# EAGLE design CO2_Ampel - V1.3 (EAGLE 9.6.2)
ORIGINATOR: Julian Weis
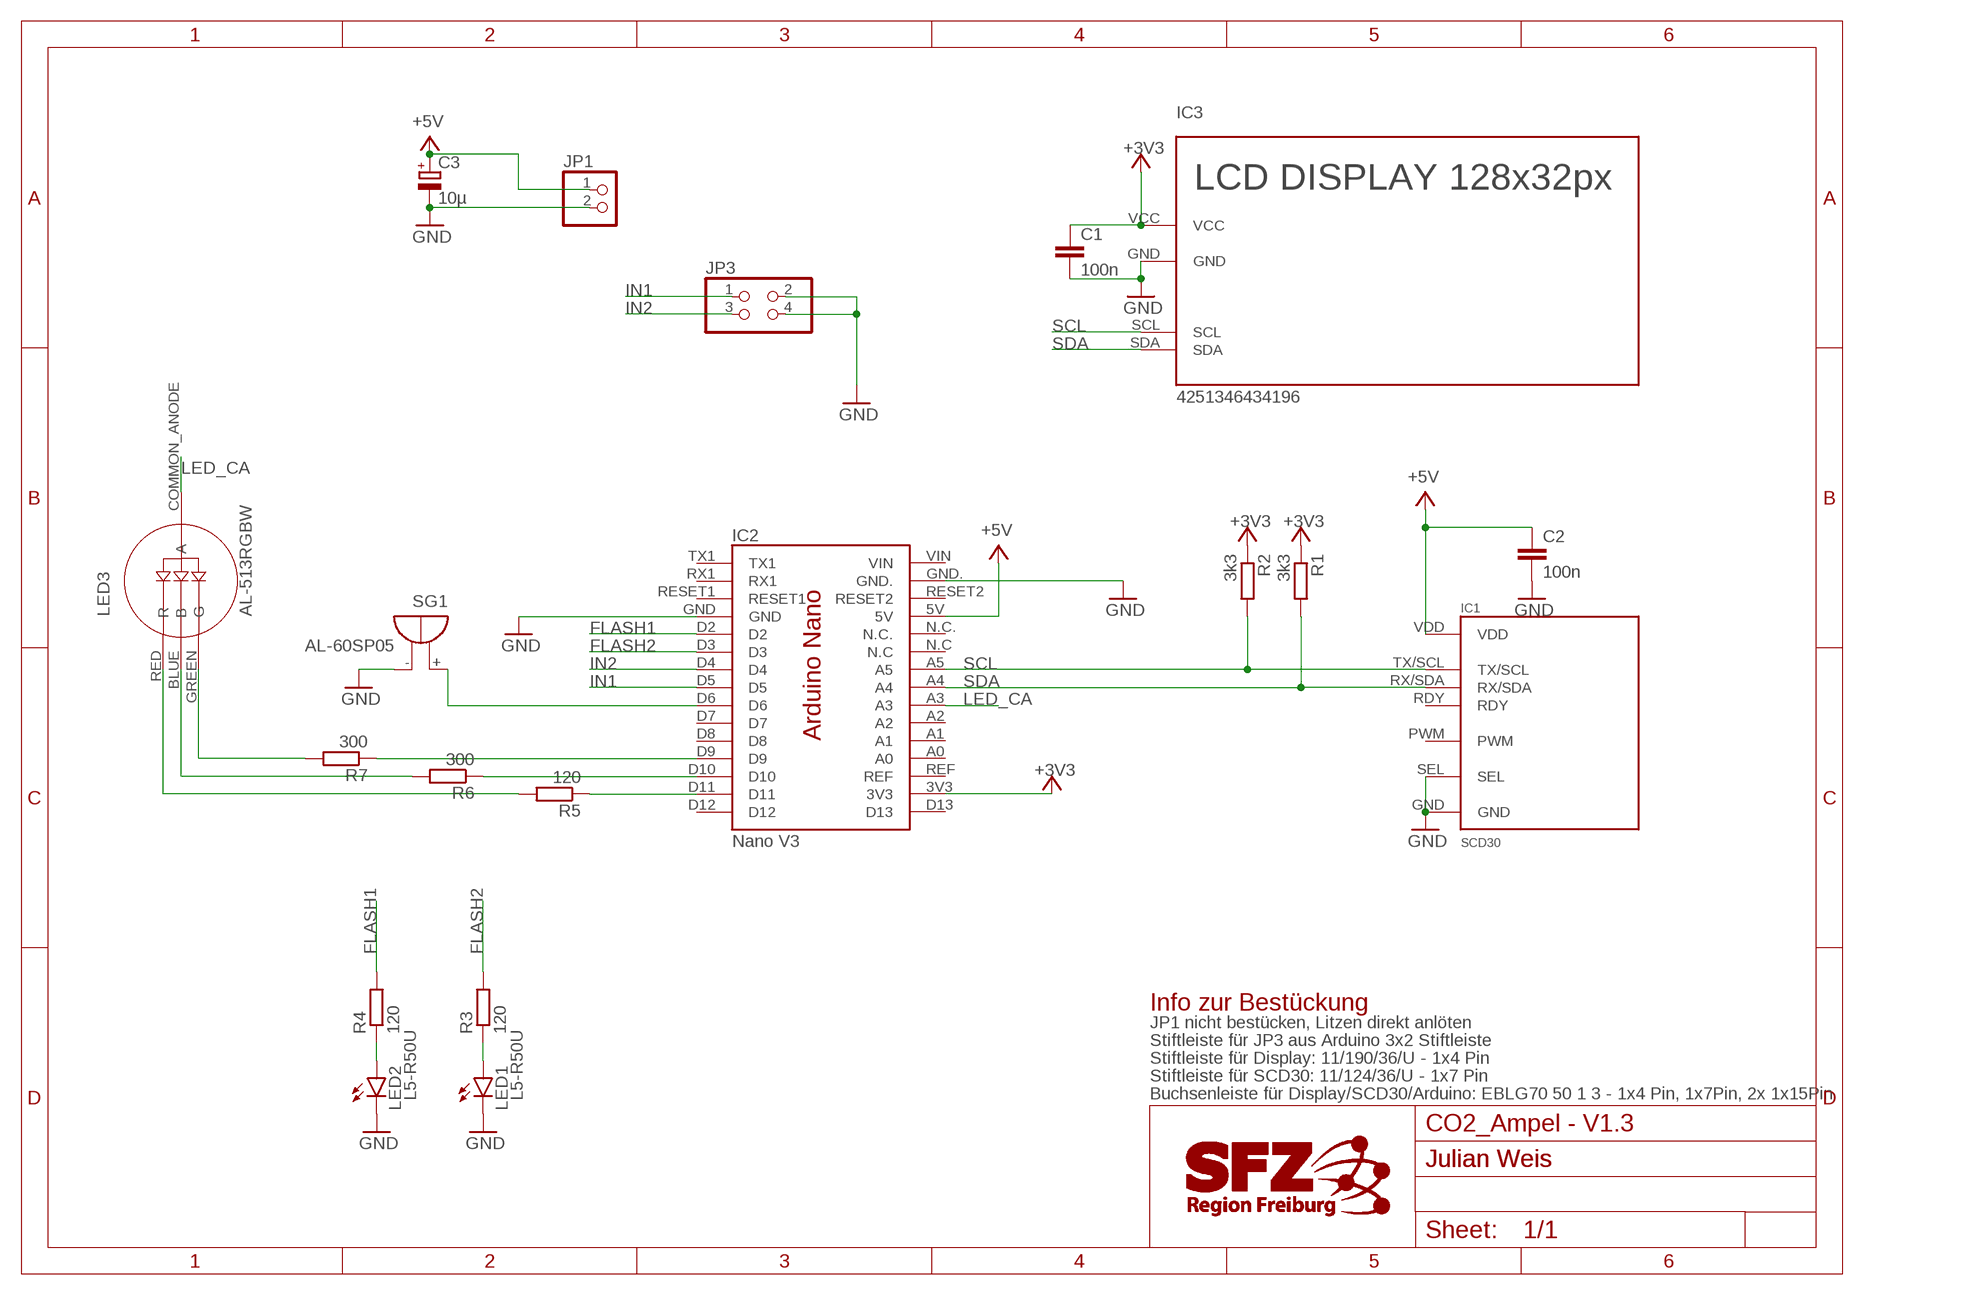
[diagram p0: schematic, sheet 1]

## Parts
C1  100n  C-EU050-025X075  [C050-025X075]
C2  100n  C-EU050-025X075  [C050-025X075]
C3  10µ  CPOL-EUE2-5  [E2-5]
IC1  SCD30  [SCD30]
IC2  Nano V3  ARDUINO_NANO  [ARDUINO_NANO]
IC3  4251346434196  0.91"OLED_128X32_I2C  [0.91INCH_128X32_I2C_12X38MM]
JP1  PINHD-1X2  [1X02]
JP3  PINHD-2X2  [2X02]
LED1  L5-R50U  LEDLED5MM_LIEGEND  [LED5MM_LIEGEND]
LED2  L5-R50U  LEDLED5MM_LIEGEND_GESPIEGELT  [LED5MM_LIEGEND_GESPIEGELT]
LED3  AL-513RGBW  LED-4_PIN  [LED-4_PIN]
R1  3k3  R-EU_0207/10  [0207/10]
R2  3k3  R-EU_0207/10  [0207/10]
R3  120  R-EU_0207/10  [0207/10]
R4  120  R-EU_0207/10  [0207/10]
R5  120  R-EU_0207/10  [0207/10]
R6  300  R-EU_0207/10  [0207/10]
R7  300  R-EU_0207/10  [0207/10]
SG1  AL-60SP05  F/TMB  [F/TMB]

## Nets
+3V3: C1.1 IC2.3V3 IC3.VCC R1.1 R2.1
+5V: C2.1 C3.+ IC1.VDD IC2.5V JP1.1
FLASH1: IC2.D2 R4.2
FLASH2: IC2.D3 R3.2
GND: C1.2 C2.2 C3.- IC1.GND IC1.SEL IC2.GND. IC3.GND JP1.2 JP3.2 JP3.4 LED1.K(C) LED2.K(C) SG1.-
IN1: IC2.D5 JP3.1
IN2: IC2.D4 JP3.3
LED_CA: IC2.A3 LED3.COMMON_ANODE(A)
N$1: LED3.RED(R) R5.2
N$2: LED3.BLUE(B) R6.2
N$3: LED2.A R4.1
N$4: LED1.A R3.1
N$5: LED3.GREEN(G) R7.2
N$6: IC2.D9 R7.1
N$7: IC2.D10 R6.1
N$8: IC2.D11 R5.1
N$9: IC2.D6 SG1.+
N$10: IC2.GND ; supply symbol labelled GND
SCL: IC1.TX/SCL IC2.A5 IC3.SCL R2.2
SDA: IC1.RX/SDA IC2.A4 IC3.SDA R1.2
Unconnected: IC1.PWM IC1.RDY IC2.A0 IC2.A1 IC2.A2 IC2.D7 IC2.D8 IC2.D12 IC2.D13 IC2.N.C IC2.N.C. IC2.REF IC2.RESET1 IC2.RESET2 IC2.RX1 IC2.TX1 IC2.VIN

## Notes on the sheet
- Info zur Bestückung
- JP1 nicht bestücken, Litzen direkt anlöten
- Stiftleiste für JP3 aus Arduino 3x2 Stiftleiste
- Stiftleiste für Display: 11/190/36/U - 1x4 Pin
- Stiftleiste für SCD30: 11/124/36/U - 1x7 Pin
- Buchsenleiste für Display/SCD30/Arduino: EBLG70 50 1 3 - 1x4 Pin, 1x7Pin, 2x 1x15Pin

## Library data of the parts
C1 C2 = rcl:C-EU: CAPACITOR, European symbol; SPICEPREFIX: C
C3 = LED_Lampe_Arduino_Eagle_V3:CPOL-EU
IC1 = sensirion:SCD30: Sensirion SCD30 Sensor Module CO2, humidity, and temperature sensor ▪ NDIR CO2 sensor technology ▪ Integrated temperature and humidity sensor ▪ Best performance-to-price ratio ▪ Dual-channel detection for superior stability ▪ Small form factor: 35 mm x 23 mm x 7 mm ▪ Measurement range: 400 ppm – 10.000 ppm ▪ Accuracy: ±(30 ppm + 3%) ▪ Current consumption: 19 mA @ 1 meas. per 2 s. ▪ Fully calibrated and linearized ▪ Digital interface UART or I2C SCD30 Datasheet <https://www.sensirion.com/fileadmin/user_upload/customers/sensirion/Dokumente/9.5_CO2/Sensirion_CO2_Sensors_SCD30_Datasheet.pdf> SCD30 Defign-In Guide <https://www.sensirion.com/fileadmin/user_upload/customers/sensirion/Dokumente/9.5_CO2/Sensirion_SCD30_Design-In_Guidelines_D1.pdf> More Downloads <https://www.sensirion.com/de/download-center/kohlendioxidsensoren-co2/co2-sensor/>
IC2 = Arduino:ARDUINO_NANO
IC3 = display-lcd:0.91"OLED_128X32_I2C
JP1 = pinhead:PINHD-1X2: PIN HEADER
JP3 = pinhead:PINHD-2X2: PIN HEADER
LED1 LED2 = led:LED: LED OSRAM: - CHIPLED LG R971, LG N971, LY N971, LG Q971, LY Q971, LO R971, LY R971 LH N974, LH R974 LS Q976, LO Q976, LY Q976 LO Q996 - Hyper CHIPLED LW Q18S LB Q993, LB Q99A, LB R99A - SideLED LS A670, LO A670, LY A670, LG A670, LP A670 LB A673, LV A673, LT A673, LW A673 LH A674 LY A675 LS A676, LA A676, LO A676, LY A676, LW A676 LS A679, LY A679, LG A679 - Hyper Micro SIDELED® LS Y876, LA Y876, LO Y876, LY Y876 LT Y87S - SmartLED LW L88C, LW L88S LB L89C, LB L89S, LG L890 LS L89K, LO L89K, LY L89K LS L896, LA L896, LO L896, LY L896 - TOPLED LS T670, LO T670, LY T670, LG T670, LP T670 LSG T670, LSP T670, LSY T670, LOP T670, LYG T670 LG T671, LOG T671, LSG T671 LB T673, LV T673, LT T673, LW T673 LH T674 LS T676, LA T676, LO T676, LY T676, LB T676, LH T676, LSB T676, LW T676 LB T67C, LV T67C, LT T67C, LS T67K, LO T67K, LY T67K, LW E67C LS E67B, LA E67B, LO E67B, LY E67B, LB E67C, LV E67C, LT E67C LW T67C LS T679, LY T679, LG T679 LS T770, LO T770, LY T770, LG T770, LP T770 LB T773, LV T773, LT T773, LW T773 LH T774 LS E675, LA E675, LY E675, LS T675 LS T776, LA T776, LO T776, LY T776, LB T776 LHGB T686 LT T68C, LB T68C - Hyper Mini TOPLED® LB M676 - Mini TOPLED Santana® LG M470 LS M47K, LO M47K, LY M47K Source: http://www.osram.convergy.de LUXEON: - LUMILED® LXK2-PW12-R00, LXK2-PW12-S00, LXK2-PW14-U00, LXK2-PW14-V00 LXK2-PM12-R00, LXK2-PM12-S00, LXK2-PM14-U00 LXK2-PE12-Q00, LXK2-PE12-R00, LXK2-PE12-S00, LXK2-PE14-T00, LXK2-PE14-U00 LXK2-PB12-K00, LXK2-PB12-L00, LXK2-PB12-M00, LXK2-PB14-N00, LXK2-PB14-P00, LXK2-PB14-Q00 LXK2-PR12-L00, LXK2-PR12-M00, LXK2-PR14-Q00, LXK2-PR14-R00 LXK2-PD12-Q00, LXK2-PD12-R00, LXK2-PD12-S00 LXK2-PH12-R00, LXK2-PH12-S00 LXK2-PL12-P00, LXK2-PL12-Q00, LXK2-PL12-R00 Source: www.luxeon.com KINGBRIGHT: KA-3528ASYC Source: www.kingbright.com
LED3 = RGB-Led:LED-4_PIN
R1-R7 = rcl:R-EU_: RESISTOR, European symbol; SPICEPREFIX: R
SG1 = buzzer:F/TMB: BUZZER Source: Buerklin; OC_FARNELL: unknown; OC_NEWARK: unknown

## Board
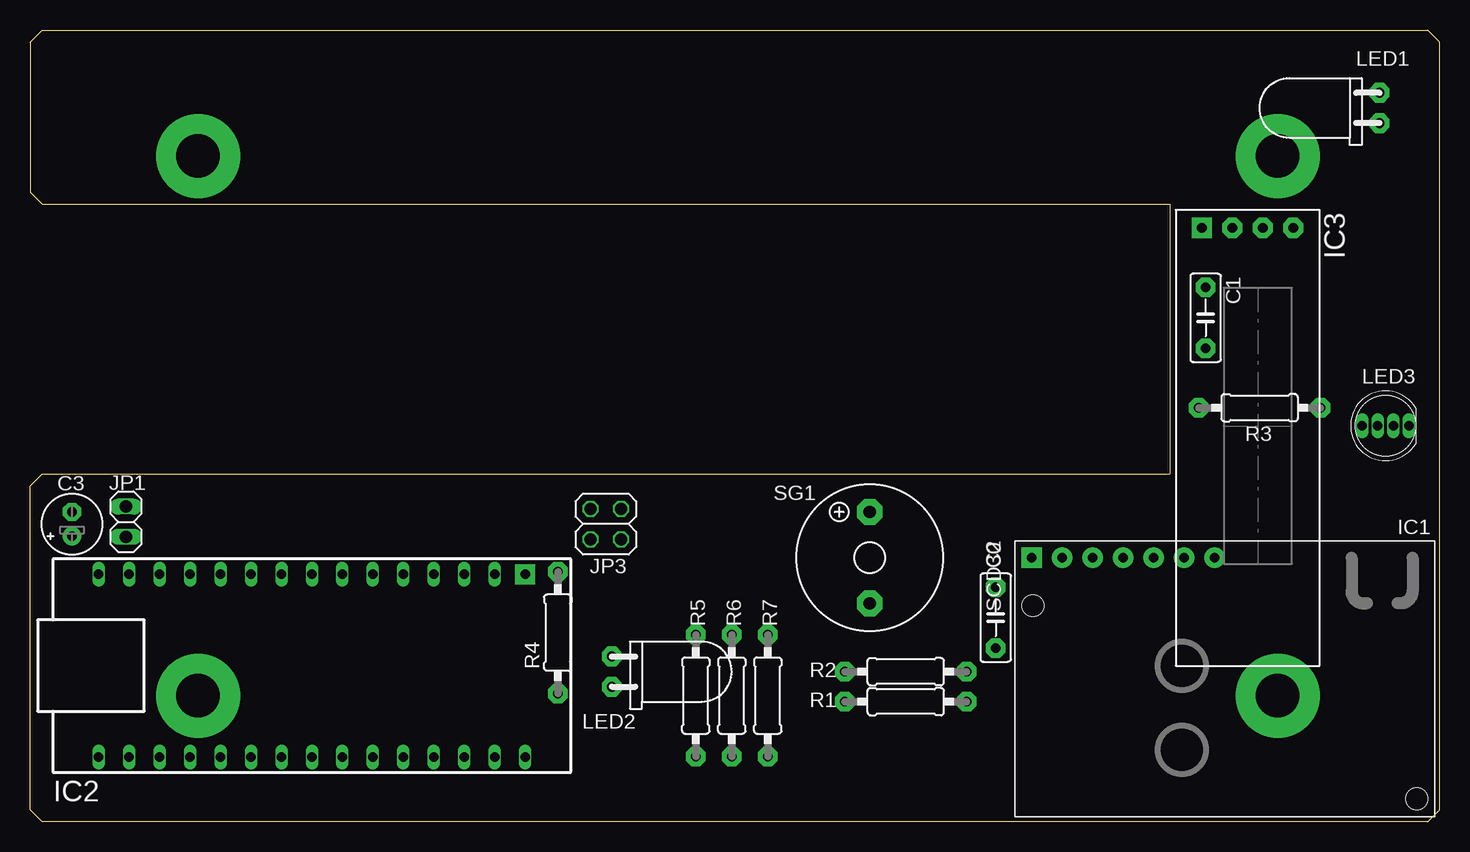
[diagram p1: board, top side]
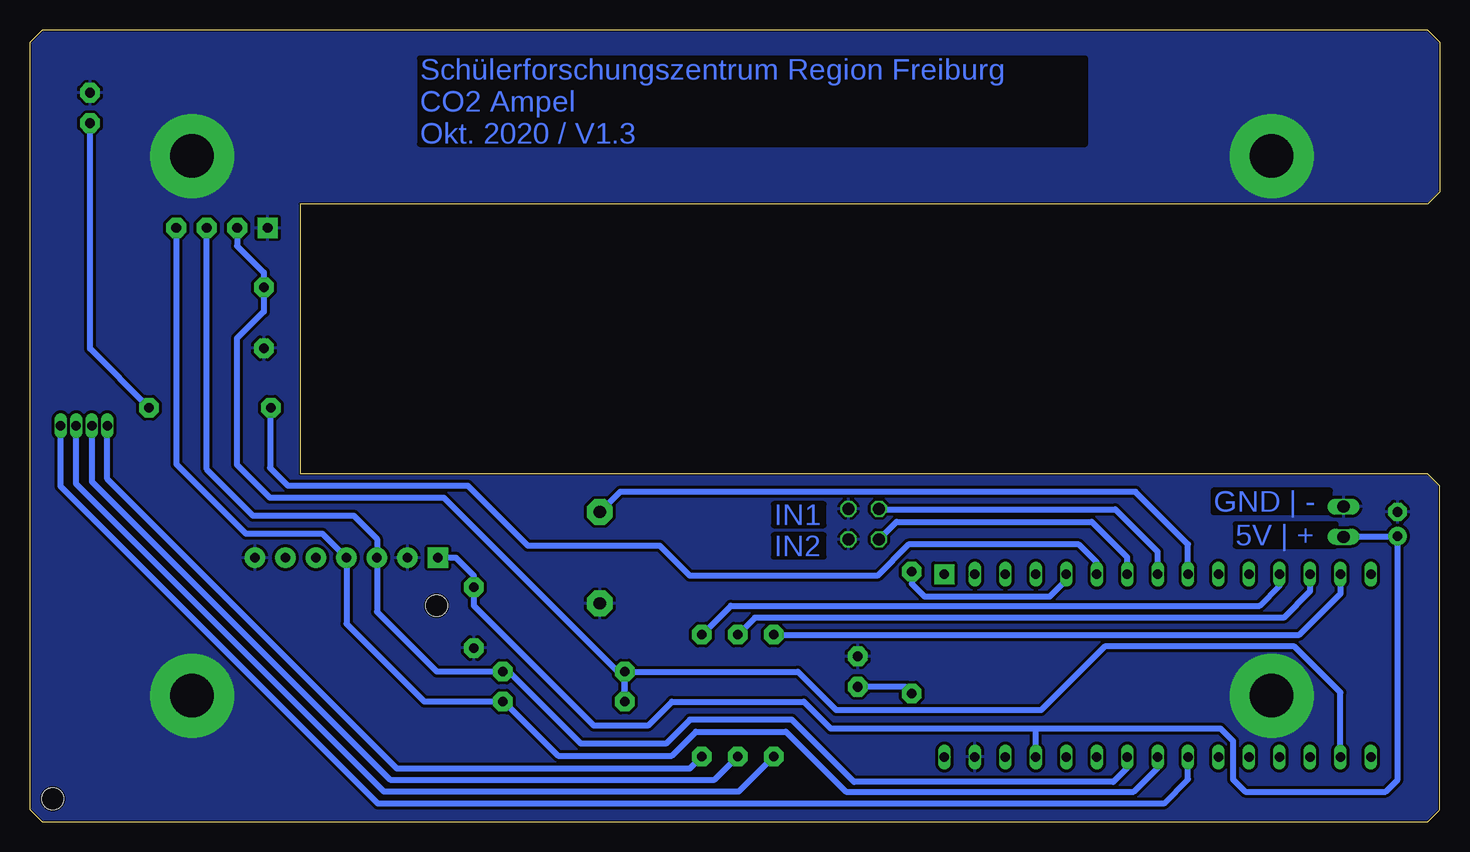
[diagram p2: board, bottom side, seen from below]

Size 117.5 x 66 mm. Coordinates in mm from the lower left corner, seen from the top.
Outline: 116.5,0 1,0 0,1 0,28 1,29 95,29 95,51.5 1,51.5 0,52.5 0,65 1,66 116.5,66 117.5,65 117.5,1 116.5,0
Copper layers (1*16): Top 0.035mm / dielectric 1.5mm / Bottom 0.035mm
Design rules "default *": minimum track width 6mil, minimum drill 0.35mm, track to track 10mil, track to pad 10mil, pad to pad 10mil, via to via 10mil, smd to smd 10mil, copper to edge 5mil, drill to drill 6mil, minimum pad ring 5mil, minimum via ring 8mil, stop-mask expansion 4mil, vias tented up to drill 0mil, thermal gap 10mil

### Footprints (pad centres in the part's own frame; a part is rotated, then mirrored left to right if it is on the bottom)
C050-025X075 = drill 0.813 pad 1.651 octagon: 1 -2.54,0; 2 2.54,0
E2-5 = drill 0.813 pad 1.524: + -1.016,0 | drill 0.813 pad 1.524 octagon: - 1.016,0
SCD30 = drill 0.8 pad 1.7: GND 0,2.54; PWM 0,12.7; RDY 0,10.16; RX/SDA 0,7.62; SEL 0,15.24; TX/SCL 0,5.08 | drill 0.8 pad 1.7 square: VDD 0,0 | hole 1.8: 4,0.1; 20.1,32.1
ARDUINO_NANO = drill 0.8 long: 3V3 7.62,-15.24; 5V 7.62,10.16; A0 7.62,-10.16; A1 7.62,-7.62; A2 7.62,-5.08; A3 7.62,-2.54; A4 7.62,0; A5 7.62,2.54; D2 -7.62,7.62; D3 -7.62,5.08; D4 -7.62,2.54; D5 -7.62,0; D6 -7.62,-2.54; D7 -7.62,-5.08; D8 -7.62,-7.62; D9 -7.62,-10.16; D10 -7.62,-12.7; D11 -7.62,-15.24; D12 -7.62,-17.78; D13 7.62,-17.78; GND -7.62,10.16; GND. 7.62,15.24; N.C 7.62,7.62; N.C. 7.62,5.08; REF 7.62,-12.7; RESET1 -7.62,12.7; RESET2 7.62,12.7; RX1 -7.62,15.24; VIN 7.62,17.78 | drill 0.8 pad 1.676 square: TX1 -7.62,17.78
0.91INCH_128X32_I2C_12X38MM = drill 0.8 pad 1.7 square: GND 0,-3.81 | drill 0.8 pad 1.7 octagon: SCL 0,1.27; SDA 0,3.81; VCC 0,-1.27
1X02 = drill 1.016 long: 1 -1.27,0; 2 1.27,0
2X02 = drill 1.016 octagon: 1 -1.27,-1.27; 2 -1.27,1.27; 3 1.27,-1.27; 4 1.27,1.27
LED5MM_LIEGEND = drill 0.813 pad 1.651 octagon: A -1.27,0; K 1.27,0
LED5MM_LIEGEND_GESPIEGELT = drill 0.813 pad 1.651 octagon: A 1.27,0; K -1.27,0
LED-4_PIN = drill 0.8 pad 1 long: BLUE 0,-0.65; COMMON_ANODE 0,1.95; GREEN 0,-1.95; RED 0,0.65
0207/10 = drill 0.813 pad 1.651 octagon: 1 -5.08,0; 2 5.08,0
F/TMB = drill 1.016 pad 2.159 octagon: + 3.81,0; - -3.81,0

### Placement (x,y rotation side)
C1  98,42 270 top
C2  80.5,17 270 top
C3  3.5,24.8 90 top
IC1  83.5,22 270 top
IC2  23.5,13 270 top
IC3  101.5,49.5 270 top
JP1  8,25 90 top
JP3  48,24.8 270 top
LED1  112.5,59.5 90 top
LED2  48.5,12.5 270 top
LED3  113,33 270 top
R1  73,10 0 top
R2  73,12.5 0 top
R3  102.5,34.5 180 top
R4  44,15.75 90 top
R5  55.5,10.5 270 top
R6  58.5,10.5 270 top
R7  61.5,10.5 270 top
SG1  70,22 90 top

### Tracks (layer width: path | path; a pad name or v marks a point on that pad's centre or on a via)
+3V3
  Bottom 0.508: IC2.3V3 8.26,10.76 12.1,14.6 27.9,14.6 33.2,9.3 50.3,9.3 53.5,12.5 R2.1 | 68,12.5 68.5,12.5 83,27 97.5,27 100.23,29.73 100.23,40.31 98.02,42.52 98.02,44.52 C1.1 98.02,44.56 98.02,45.79 100.23,48 IC3.VCC | R2.1 R1.1 67.92,12.42 68,12.5 | R2.1 68,12.5
+5V
  Bottom 0.508: JP1.1 3.55,23.73 C3.+ 3.5,3.5 4.5,2.5 16.2,2.5 17.2,3.5 17.2,6.7 18.25,7.75 33.6,7.75 | IC1.VDD 82,22 80.5,20.5 C2.1 80.5,18 70.5,8 66,8 64,10 53,10 50.75,7.75 33.6,7.75 | IC2.5V 33.66,7.69 33.6,7.75
FLASH1
  Bottom 0.508: IC2.D2 31.12,20.14 32.5,18.76 42.93,18.76 44,19.83 R4.2
FLASH2
  Bottom 0.508: IC2.D3 28.58,21.62 30.05,23.09 44.28,23.09 46.87,20.5 62.5,20.5 65,23 76,23 81,28 96,28 97.5,29.5 97.5,34.42 R3.2
GND  (via drill 3.6 pad 7)
  other vias: 14,10.5 14,55.5 104,10.5 104,55.5
  pour Bottom: 0,0 0,67 117.5,67 117.5,1 116.5,0
IN1
  Bottom 0.508: IC2.D5 23.5,22.5 27.04,26.04 46.7,26.04 JP3.1
IN2
  Bottom 0.508: IC2.D4 26.04,22.04 29,25 45.26,25 JP3.3
LED_CA
  Bottom 0.508: IC2.A3 20.96,3.54 23,1.5 88.5,1.5 114.95,27.95 LED3.COMMON_ANODE
N$1
  Bottom 0.508: R5.2 58.42,2.5 88,2.5 113.65,28.15 LED3.RED
N$2
  Bottom 0.508: R6.2 60.42,3.5 87.5,3.5 112.35,28.35 LED3.BLUE
N$3
  Bottom 0.508: R4.1 44.56,11.23 LED2.A
N$4
  Bottom 0.508: R3.1 112.5,39.42 LED1.A
N$5
  Bottom 0.508: R7.2 62.5,4.42 86.92,4.42 111.05,28.55 LED3.GREEN
N$6
  Bottom 0.508: IC2.D9 13.34,19.66 15,18 59.08,18 R7.1
N$7
  Bottom 0.508: IC2.D10 10.8,19.2 13,17 57.08,17 R6.1
N$8
  Bottom 0.508: IC2.D11 8.26,19 11.68,15.58 R5.1
N$9
  Bottom 0.508: IC2.D6 20.96,23.12 25.34,27.5 68.31,27.5 SG1.+
SCL
  Bottom 0.508: IC2.A5 26.04,4.46 27.2,3.3 48.8,3.3 54,8.5 62.5,8.5 64.5,6.5 71.58,6.5 77.58,12.5 R2.2 83.58,12.5 88.58,17.5 IC1.TX/SCL 88.58,23.58 90.5,25.5 98.9,25.5 102.77,29.37 IC3.SCL
SDA
  Bottom 0.508: IC2.A4 23.5,4.5 25.5,2.5 49.5,2.5 54.5,7.5 62,7.5 64,5.5 73.5,5.5 78,10 R1.2 84.62,10 91.12,16.5 IC1.RX/SDA 93.12,24 99.5,24 105.31,29.81 IC3.SDA

### Text on the board
Bottom: Schülerforschungszentrum Region Freiburg / CO2 Ampel / Okt. 2020 / V1.3 | GND | - | IN1 | 5V | + | IN2